# Altium schematic sheet H-BRIDGE.SchDoc
size A; SheetNumber: 2; SheetTotal: 9
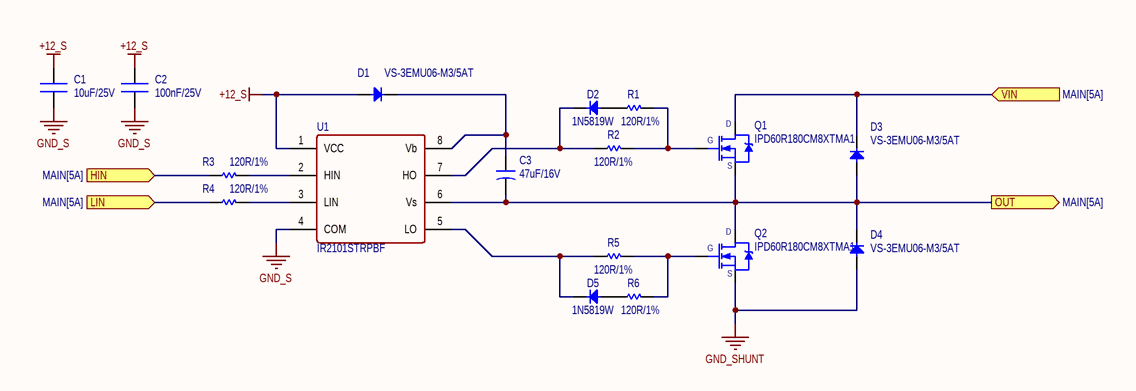
[diagram p0: H-BRIDGE.SchDoc]

## Parts
C1  10uF/25V  [CN-SMD-0603]
C2  100nF/25V  [CN-SMD-0603]
C3  47uF/16V  [Tantalum 1210]
D1  VS-3EMU06-M3/5AT  [DIO-SMD-A]
D2  1N5819W  [DIO-SMD-123]
D3  VS-3EMU06-M3/5AT  [DIO-SMD-A]
D4  VS-3EMU06-M3/5AT  [DIO-SMD-A]
D5  1N5819W  [DIO-SMD-123]
Q1  IPD60R180CM8XTMA1  [TO252-123]
Q2  IPD60R180CM8XTMA1  [TO252-123]
R1  120R/1%  [RES-SMD-0603]
R2  120R/1%  [RES-SMD-0603]
R3  120R/1%  [RES-SMD-0603]
R4  120R/1%  [RES-SMD-0603]
R5  120R/1%  [RES-SMD-0603]
R6  120R/1%  [RES-SMD-0603]
U1  IR2101STRPBF  [SO8]

## Ports
HIN (in, see MAIN[5A]), LIN (in, see MAIN[5A]), OUT (out, see MAIN[5A]), VIN (in, see MAIN[5A])

## Nets
+12_S: C1.2 C2.2 D1.1(A) U1.1(VCC)
GND_S: C1.1 C2.1 U1.4(COM)
GND_SHUNT: D4.1(A) Q2.3(S)
HIN: R3.1 ; port HIN
LIN: R4.1 ; port LIN
OUT: C3.2 D3.1(A) D4.2(K) Q1.3(S) Q2.2(D) U1.6(Vs) ; port OUT
VIN: D3.2(K) Q1.2(D) ; port VIN
NetC3_1: C3.1 D1.2(K) U1.8(Vb)
NetD2_1: D2.1(A) R1.1
NetD2_2: D2.2(K) R2.1 U1.7(HO)
NetD5_1: D5.1(A) R6.1
NetD5_2: D5.2(K) R5.1 U1.5(LO)
NetQ1_1: Q1.1(G) R1.2 R2.2
NetQ2_1: Q2.1(G) R5.2 R6.2
NetR3_2: R3.2 U1.2(HIN)
NetR4_2: R4.2 U1.3(LIN)

## Library data of the parts
C1 = CN: 0603W106M250XD; PN: 0603W106M250XD
C2 = CN: CL10B104KA8NNNC; PN: CL10B104KA8NNNC
C3 = CN-SMD: TCNT476M016R0200; PN: TCNT476M016R0200; LatestRevisionDate: 17-Jul-2002; LatestRevisionNote: Re-released for DXP Platform.; PackageReference: POLAR0.8; Publisher: Altium Limited
D1-D5 = Diode SMD: Code - JEDEC: DO-214-AB; Published: 8-Jun-2000; Revision: July-2002: Re-released for DXP Platform.; Publisher: Altium Limited
  D1 D3 D4: PN: VS-3EMU06-M3/5AT
  D2 D5: PN: 1N5819W
Q1 Q2 = FDD8870: PN: IPD60R180CM8XTMA1
R1-R6 = Res-SMD: ERJ-3EKF1200V; Manufacturer: Generic Components; Class: Passive; PN: ERJ-3EKF1200V; Publisher: Altium Hobart Technology Centre
U1 = IR2101S: PN: IR2101STRPBF